# EAGLE design ProtoPowerSupply (EAGLE 7.6.0)
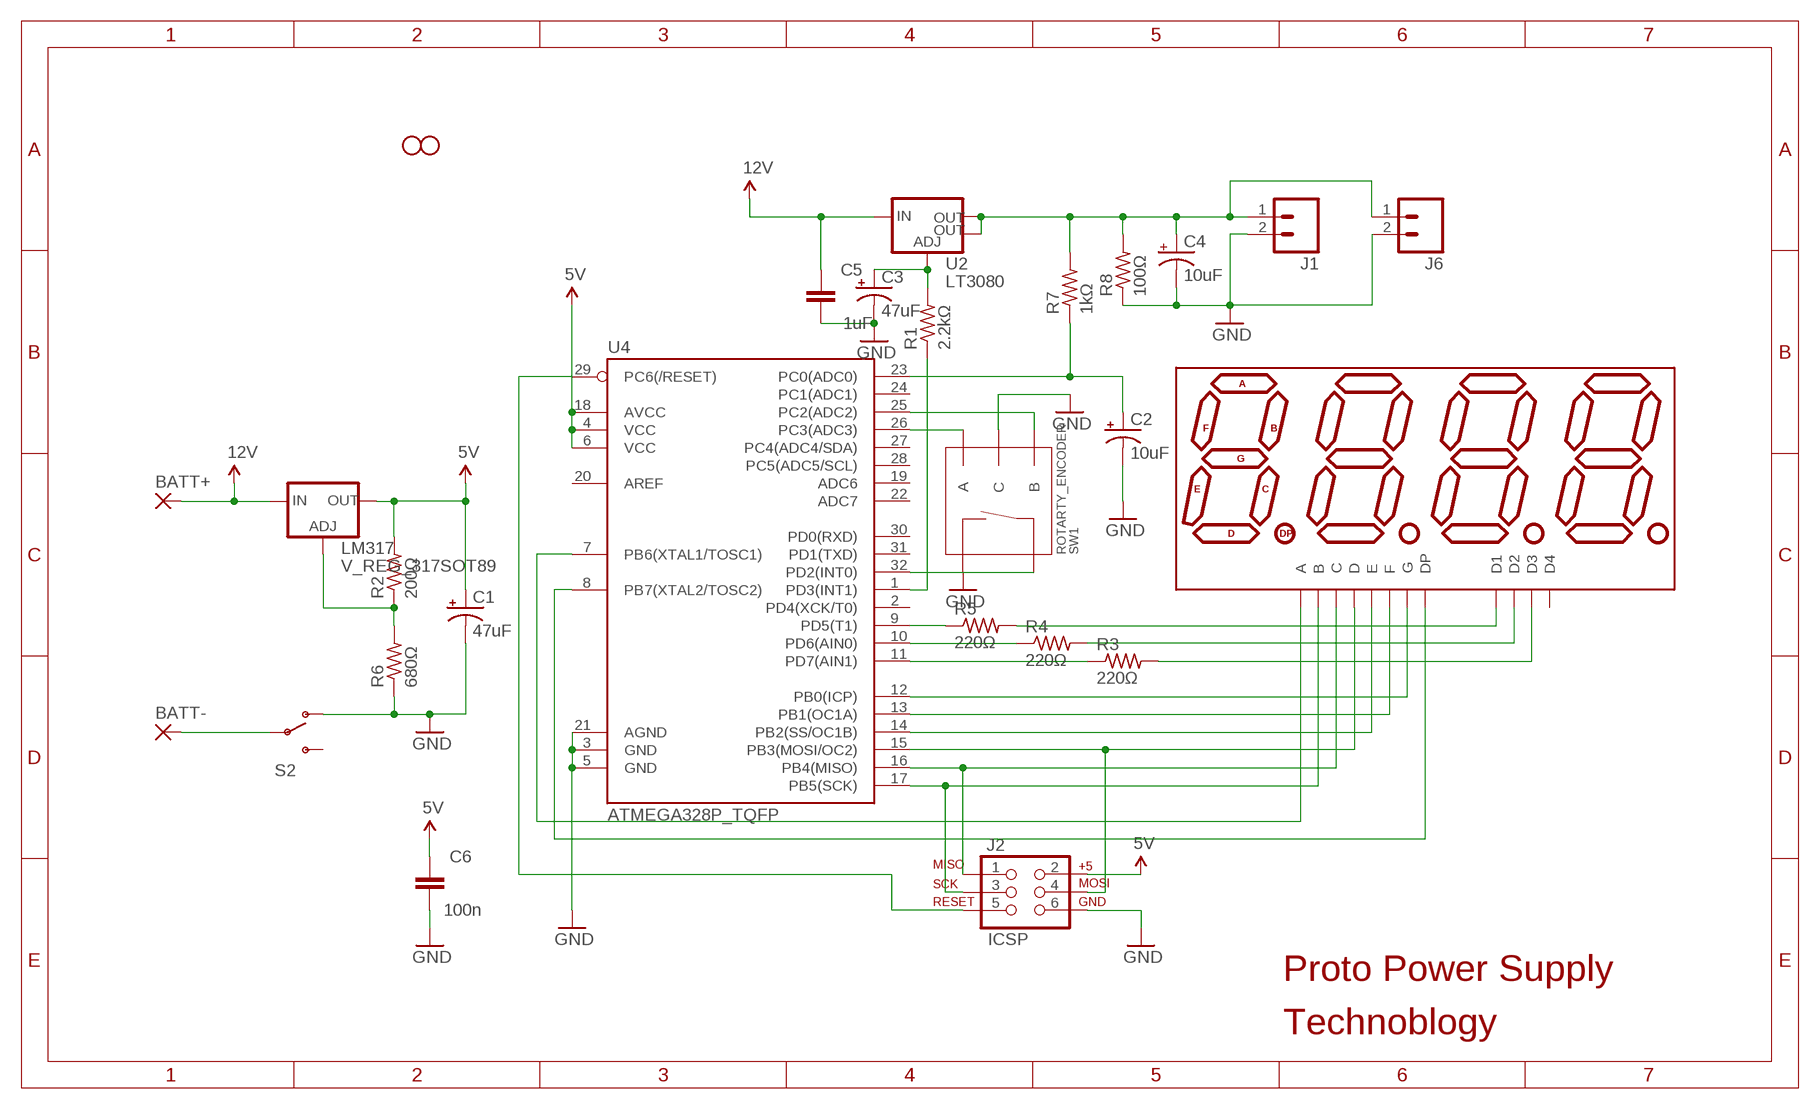
[diagram p0: schematic, sheet 1]

## Parts
BATT+  1,6/0,9  [1,6/0,9]
BATT-  1,6/0,9  [1,6/0,9]
C1  47uF  CAP_POLPTH2  [CPOL-RADIAL-10UF-25V]
C2  10uF  CAP_POLPTH2  [CPOL-RADIAL-10UF-25V]
C3  47uF  CAP_POLPTH2  [CPOL-RADIAL-10UF-25V]
C4  10uF  CAP_POLPTH2  [CPOL-RADIAL-10UF-25V]
C5  1uF  CAP0603-CAP  [0603-CAP]
C6  100n  CAP0603-CAP  [0603-CAP]
DISP1  KYX-2381  7-SEGMENT-4DIGIT-COUNTER-KYX-2381  [KYX-2381]
J1  M021X02_NO_SILK  [1X02_NO_SILK]
J2  ICSP  AVR_SPI_PRG_6PTH  [2X3]
J6  M021X02_NO_SILK  [1X02_NO_SILK]
JP4  STAND-OFF  [STAND-OFF]
JP5  STAND-OFF  [STAND-OFF]
LM317  V_REG_317SOT89  [SOT89]
R1  2.2kΩ  R-US_R0805  [R0805]
R2  200Ω  R-US_R0805  [R0805]
R3  220Ω  R-US_R0805  [R0805]
R4  220Ω  R-US_R0805  [R0805]
R5  220Ω  R-US_R0805  [R0805]
R6  680Ω  R-US_R0805  [R0805]
R7  1kΩ  R-US_R0805  [R0805]
R8  100Ω  R-US_R0805  [R0805]
S2  SWITCH-SPDTPTH  [SWITCH-SPDT]
SW1  ROTARTY_ENCODER  [ROTARY_ENC_PLAIN]
U2  LT3080  V_REG_LM1117SOT223  [SOT223]
U4  ATMEGA328P_TQFP  [TQFP32-08]

## Nets
5V: C1.1(+) C6.1 J2.2 LM317.2(OUT) R2.2 U4.4(VCC) U4.6(VCC) U4.18(AVCC)
12V: BATT+.1(P) C5.1 LM317.3(IN) U2.3(IN)
GND: C1.2(-) C2.2(-) C3.2(-) C4.2(-) C5.2 C6.2 J1.2 J2.6 J6.2 R6.1 R8.1 S2.1(O) SW1.C SW1.SW- U4.3(GND) U4.5(GND) U4.21(AGND)
N$2: DISP1.5(G) U4.12(PB0(ICP))
N$4: C2.1(+) R7.1 U4.23(PC0(ADC0))
N$5: C3.1(+) R1.2 U2.1(ADJ)
N$6: BATT-.1(P) S2.2(P)
N$7: DISP1.10(F) U4.13(PB1(OC1A))
N$8: DISP1.1(E) U4.14(PB2(SS/OC1B))
N$9: DISP1.2(D) J2.4 U4.15(PB3(MOSI/OC2))
N$10: DISP1.4(C) J2.1 U4.16(PB4(MISO))
N$11: DISP1.7(B) J2.3 U4.17(PB5(SCK))
N$12: DISP1.11(A) U4.7(PB6(XTAL1/TOSC1))
N$13: DISP1.12(D1) R5.2
N$14: DISP1.3(DP) U4.8(PB7(XTAL2/TOSC2))
N$15: DISP1.9(D2) R4.2
N$16: DISP1.8(D3) R3.2
N$17: R5.1 U4.9(PD5(T1))
N$18: R4.1 U4.10(PD6(AIN0))
N$19: R3.1 U4.11(PD7(AIN1))
N$20: SW1.B U4.25(PC2(ADC2))
N$21: SW1.SW+ U4.32(PD2(INT0))
N$27: SW1.A U4.26(PC3(ADC3))
N$29: J2.5 U4.29(PC6(/RESET))
N$30: R1.1 U4.1(PD3(INT1))
N$31: C4.1(+) J1.1 J6.1 R7.2 R8.2 U2.2(OUT) U2.4(OUT)
N$34: LM317.1(ADJ) R2.1 R6.2
Unconnected: DISP1.6(D4) S2.3(S) U4.2(PD4(XCK/T0)) U4.19(ADC6) U4.20(AREF) U4.22(ADC7) U4.24(PC1(ADC1)) U4.27(PC4(ADC4/SDA)) U4.28(PC5(ADC5/SCL)) U4.30(PD0(RXD)) U4.31(PD1(TXD))

## Notes on the sheet
- Proto Power Supply
- Technoblogy

## Library data of the parts
BATT+ BATT- = wirepad:1,6/0,9: THROUGH-HOLE PAD
C1-C4 = SparkFun-Capacitors:CAP_POL: Capacitor Polarized These are standard SMD and PTH capacitors. Normally 10uF, 47uF, and 100uF in electrolytic and tantalum varieties. Always verify the external diameter of the through hole cap, it varies with capacity, voltage, and manufacturer. The EIA devices should be standard.
C5 C6 = SparkFun-Capacitors:CAP: Capacitor Standard 0603 ceramic capacitor, and 0.1" leaded capacitor.
DISP1 = djd-displays:7-SEGMENT-4DIGIT-COUNTER
J1 J6 = SparkFun-Connectors:M02: Standard 2-pin 0.1" header. Use with - straight break away headers ( PRT-00116) - right angle break away headers (PRT-00553) - swiss pins (PRT-00743) - machine pins (PRT-00117) - female headers (PRT-00115) Molex polarized connector foot print use with: PRT-08233 with associated crimp pins and housings. 2.54_SCREWTERM for use with PRT-10571. 3.5mm Screw Terminal footprints for PRT-08084 5mm Screw Terminal footprints for use with PRT-08432
J2 = SparkFun:AVR_SPI_PRG_6: AVR ISP 6 Pin This is the reduced ISP connector for AVR programming. Common on Arduino. This footprint will take up less PCB space and can be used with a 10-pin to 6-pin adapter such as SKU: BOB-08508
JP4 JP5 = SparkFun:STAND-OFF: Stand Off This is the mechanical footprint for a #4 phillips button head screw. Use the keepout ring to avoid running the screw head into surrounding components. SKU : PRT-00447
LM317 = technoblogy:V_REG_317: Voltage Regulator Standard LM317 adjustable voltage regulator. AOI (Adjust Output Input). Google 'LM317 Calculator' for easy to use app to get the two resistor values needed. 240/720 for 5V output. 240/390 for 3.3V output. Spark Fun Electronics SKU : COM-00527
R1-R8 = adafruit:R-US_: RESISTOR, American symbol
S2 = SparkFun-Electromechanical:SWITCH-SPDT: SPDT Switch Simple slide switch, Spark Fun Electronics SKU : COM-00102 DPDT SMT slide switch, AYZ0202, SWCH-08179; PROD_ID: SWCH-08261
SW1 = SparkFun-Electromechanical:ROTARTY_ENCODER: Simple no LED rotary encoder Example: COM-09117
U2 = SparkFun-PowerIC:V_REG_LM1117: Voltage Regulator LM1117 Standard adjustable voltage regulator but in SMD form. Spark Fun Electronics SKU : COM-00595; PROD_ID: VREG-08170
U4 = SparkFun-DigitalIC:ATMEGA328P_TQFP; PROD_ID: IC-09069

## Board
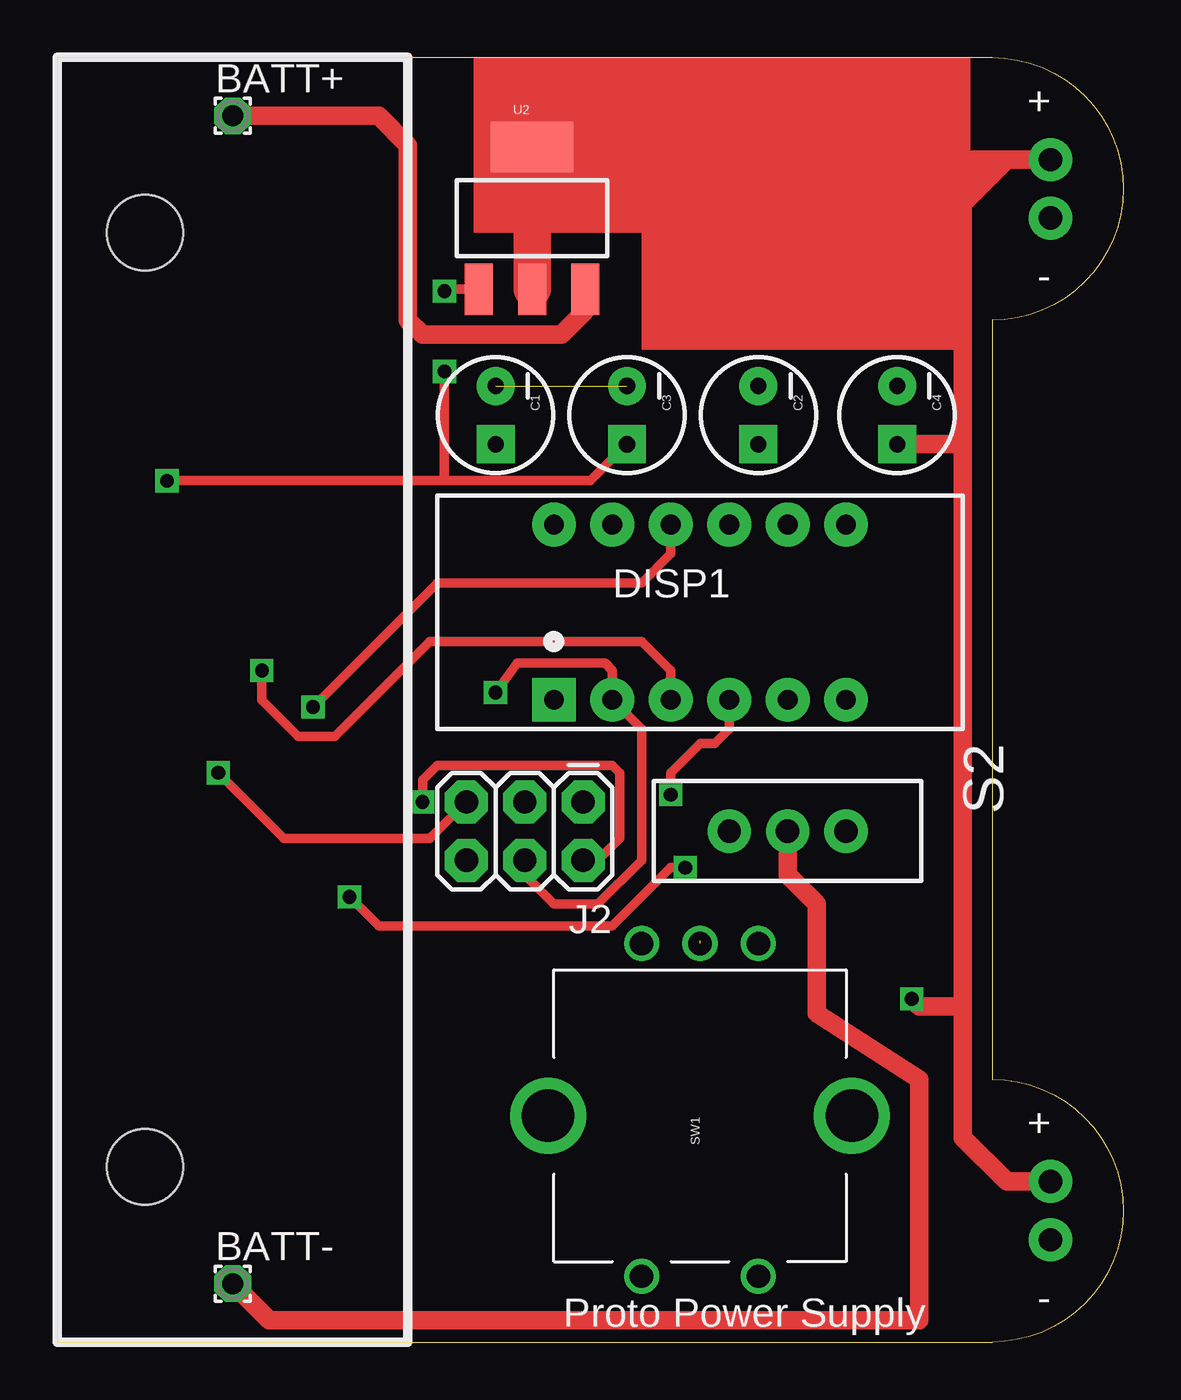
[diagram p1: board, top side]
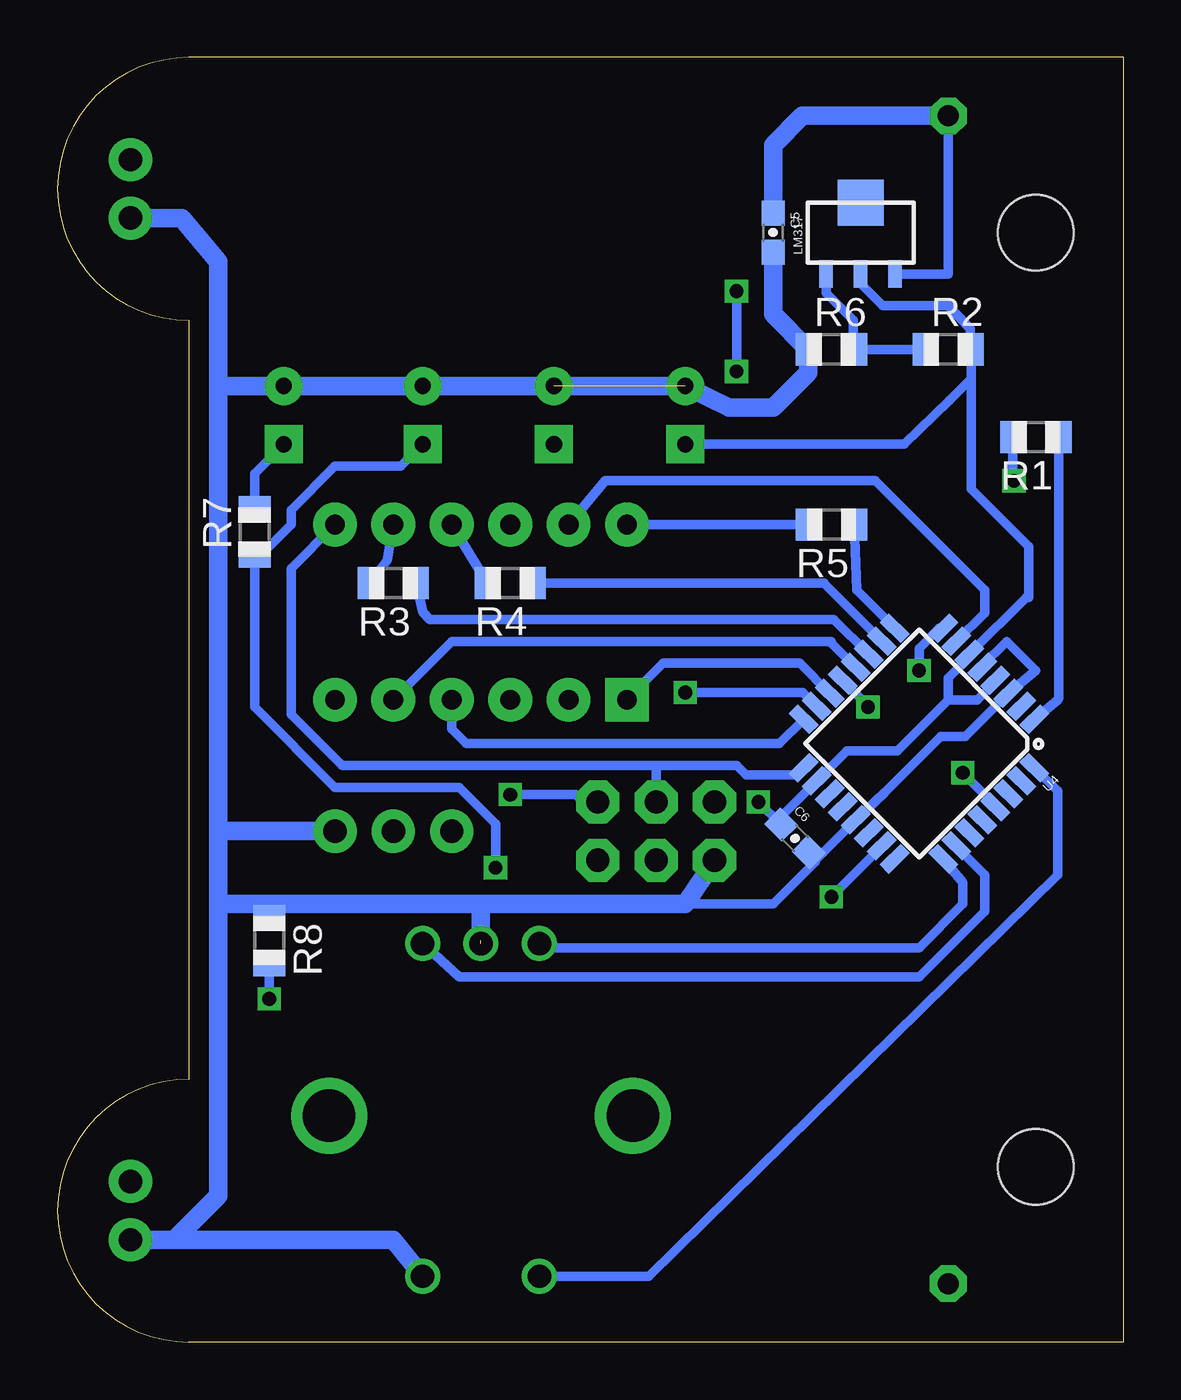
[diagram p2: board, bottom side, seen from below]

Size 46.36 x 55.88 mm. Coordinates in mm from the lower left corner, seen from the top.
Outline: 0,0 40.64,0 arc180 40.64,11.43 40.64,44.45 arc180 40.64,55.88 0,55.88 0,0
Copper layers (1*16): Top 0.035mm / dielectric 1.5mm / Bottom 0.035mm
Design rules "default": minimum track width 10mil, minimum drill 24mil, track to track 8mil, track to pad 8mil, pad to pad 8mil, via to via 8mil, smd to smd 8mil, copper to edge 40mil, drill to drill 8mil, minimum pad ring 10mil, minimum via ring 8mil, stop-mask expansion 4mil, vias tented up to drill 0mil, thermal gap 10mil

### Footprints (pad centres in the part's own frame; a part is rotated, then mirrored left to right if it is on the bottom)
1,6/0,9 = drill 0.914 pad 1.6 octagon: 1 0,0
CPOL-RADIAL-10UF-25V = drill 0.7 pad 1.651 square: 1 1.27,0 | drill 0.7 pad 1.651: 2 -1.27,0
0603-CAP = smd 1.1 x 1: 1 -0.85,0; 2 0.85,0
KYX-2381 = drill 0.864 pad 1.905 square: 1 -6.35,-3.81 | drill 0.864 pad 1.905: 2 -3.81,-3.81; 3 -1.27,-3.81; 4 1.27,-3.81; 5 3.81,-3.81; 6 6.35,-3.81; 7 6.35,3.81; 8 3.81,3.81; 9 1.27,3.81; 10 -1.27,3.81; 11 -3.81,3.81; 12 -6.35,3.81
1X02_NO_SILK = drill 1.016 pad 1.88: 1 0,0; 2 2.54,0
2X3 = drill 1.016 pad 1.88 octagon: 1 0,0; 2 0,2.54; 3 2.54,0; 4 2.54,2.54; 5 5.08,0; 6 5.08,2.54
STAND-OFF = hole 3.302: 0,0
SOT89 = smd 0.58 x 1.2: 1 -1.5,-1.8; 2 0,-1.8; 3 1.5,-1.8 | smd 2 x 2: 4 0,1.3
R0805 = smd 1.1 x 1.4: 1 -1,0; 2 1,0
SWITCH-SPDT = drill 1.016 pad 1.88: 1 0,2.54; 2 0,0; 3 0,-2.54
ROTARY_ENC_PLAIN = drill 1.016: A 7.493,-2.54; B 7.493,2.54; C 7.493,0; SW+ -6.985,2.54; SW- -6.985,-2.54 | drill 2.286: P$3 0,6.604; P$4 0,-6.604
SOT223 = smd 1.219 x 2.235: 1 -2.311,-3.099; 2 0,-3.099; 3 2.311,-3.099 | smd 3.6 x 2.2: 4 0,3.099
TQFP32-08 = smd 1.27 x 0.559: 1 -4.293,2.8; 2 -4.293,2; 3 -4.293,1.2; 4 -4.293,0.4; 5 -4.293,-0.4; 6 -4.293,-1.2; 7 -4.293,-2; 8 -4.293,-2.8; 17 4.293,-2.8; 18 4.293,-2; 19 4.293,-1.2; 20 4.293,-0.4; 21 4.293,0.4; 22 4.293,1.2; 23 4.293,2; 24 4.293,2.8 | smd 0.559 x 1.27: 9 -2.8,-4.293; 10 -2,-4.293; 11 -1.2,-4.293; 12 -0.4,-4.293; 13 0.4,-4.293; 14 1.2,-4.293; 15 2,-4.293; 16 2.8,-4.293; 25 2.8,4.293; 26 2,4.293; 27 1.2,4.293; 28 0.4,4.293; 29 -0.4,4.293; 30 -1.2,4.293; 31 -2,4.293; 32 -2.8,4.293

### Placement (x,y rotation side)
BATT+  7.62,53.34 0 top
BATT-  7.62,2.54 0 top
C1  19.05,40.32 270 top
C2  30.48,40.32 270 top
C3  24.77,40.32 270 top
C4  36.51,40.32 270 top
C5  15.24,48.26 270 bottom
C6  14.29,21.91 315 bottom
DISP1  27.94,31.75 0 top
J1  43.18,6.99 270 top
J2  22.86,23.5 180 top
J6  43.18,51.44 270 top
JP4  3.81,48.26 0 top
JP5  3.81,7.62 0 top
LM317  11.43,48.26 0 bottom
R1  3.81,39.37 180 bottom
R2  7.62,43.18 0 bottom
R3  31.75,33.02 180 bottom
R4  26.67,33.02 180 bottom
R5  12.7,35.56 180 bottom
R6  12.7,43.18 0 bottom
R7  37.78,35.24 90 bottom
R8  37.15,17.46 270 bottom
S2  31.75,22.23 270 top
SW1  27.94,9.84 90 top
U2  20.64,48.9 0 top
U4  8.89,26.04 225 bottom

### Tracks (layer width: path | path; a pad name or v marks a point on that pad's centre or on a via)
5V  (via drill 0.6)
  Top 0.406: J2.2 23.5,20.95 24.45,21.91 24.45,24.77 24.13,25.08 16.51,25.08 15.88,24.45 v15.88,23.5
  Bottom 0.406: 6.62,41.91 R2.2 6.67,44.09 7.62,45.09 10.48,45.09 11.43,46.04 LM317.2 | 6.62,41.91 6.62,37.1 4.13,34.61 4.13,32.38 4.24,32.38 U4.6 6.7,29.81 7.62,28.89 7.62,27.94 | 7.62,27.94 9.84,25.72 12.04,25.72 U4.18 14.89,22.86 C6.1 v15.88,23.5 | C1.1 9.53,39.05 7.57,40.96 6.62,41.91 | U4.4 5.57,28.72 6.35,27.94 7.62,27.94 | v15.88,23.5
12V
  Top 0.813: 8.89,53.34 BATT+.1 13.97,53.34 15.24,52.07 15.24,44.45 15.88,43.81 21.91,43.81 22.95,44.86 U2.3
  Bottom 0.406: BATT+.1 7.62,46.46 LM317.3
  Bottom 0.813: C5.1 15.24,52.07 13.97,53.34 BATT+.1
GND  (2 unrouted)
  Bottom 0.406: U4.21 10.37,23.92 7.94,26.35 6.88,26.35 U4.3 3.81,29.21 5.08,30.48 6.14,29.42 U4.5 | U4.21 13.4,20.95 13.4,20.89 15.24,19.05 19.05,19.05 | 39.37,41.59 39.37,41.91 | 39.32,13.92 39.37,15.24 | C6.2 13.05,21.31 U4.21
  Bottom 0.813: J6.2 40.96,48.9 39.37,46.99 39.37,41.91 39.37,22.23 | 39.37,22.23 39.37,19.05 | 39.37,19.05 39.37,15.24 39.37,6.35 41.27,4.45 | 41.27,4.45 J1.2 | S2.1 39.37,22.23 | 41.27,4.45 31.75,4.45 SW1.SW- | 39.37,41.59 C4.2 C2.2 C1.2 17.14,40.64 15.24,40.64 13.7,42.18 R6.1 15.24,44.72 C5.2 | J2.6 19.05,19.05 27.94,19.05 | 27.94,19.05 36.83,19.05 | 36.83,19.05 39.37,19.05 | 27.94,17.46 27.94,19.05 | R8.1 36.83,18.78 36.83,19.05
N$2
  Bottom 0.406: DISP1.5 29.21,30.48 12.7,30.48 12.7,30.41 U4.12
N$4  (via drill 0.6)
  Top 0.406: v12.7,19.37 13.97,18.1 24.13,18.1 26.67,20.64 v27.3,20.64
  Bottom 0.406: C2.1 31.43,38.1 34.29,38.1 36.2,36.2 36.2,35.56 37.51,34.24 R7.1 37.78,27.62 34.29,24.13 28.89,24.13 27.3,22.54 v27.3,20.64 | U4.23 10.51,21.56 v12.7,19.37
N$5  (via drill 0.6)
  Top 0.406: v4.76,37.47 16.83,37.47 | 16.83,37.47 23.18,37.47 C3.1 | U2.1 16.51,45.8 v16.83,45.72 | v16.83,42.23 16.83,37.47
  Bottom 0.406: R1.2 4.81,37.51 v4.76,37.47 | v16.83,45.72 v16.83,42.23
N$6
  Top 0.813: BATT-.1 9.21,0.95 37.47,0.95 37.47,11.43 33.02,14.29 33.02,19.05 31.75,20.32 S2.2
N$7  (via drill 0.6)
  Top 0.406: v11.11,27.62 16.51,33.02 25.4,33.02 26.67,34.29 DISP1.10
  Bottom 0.406: U4.13 11.11,27.69 v11.11,27.62
N$8
  Bottom 0.406: DISP1.1 20,29.53 14.08,29.53 U4.14
N$9  (via drill 0.6)
  Top 0.406: J2.4 20.32,20.32 21.59,19.05 23.5,19.05 25.4,20.95 25.4,26.67 DISP1.2 24.13,29.21 23.81,29.53 20,29.53 v19.05,28.26
  Bottom 0.406: U4.15 13.94,28.26 v19.05,28.26
N$10  (via drill 0.6)
  Top 0.406: v26.67,23.81 26.67,24.77 27.94,26.04 28.57,26.04 29.21,26.67 DISP1.4
  Bottom 0.406: U4.16 14.96,26.04 28.57,26.04 29.21,26.67 DISP1.4 | J2.1 23.5,23.5 23.81,23.81 v26.67,23.81
N$11
  Bottom 0.406: DISP1.7 36.2,33.66 36.2,27.3 33.97,25.08 20.32,25.08 | 20.32,25.08 16.83,25.08 16.41,24.66 14.22,24.66 U4.17 | J2.3 20.32,25.08
N$12
  Bottom 0.406: DISP1.11 22.54,37.47 10.79,37.47 6.03,32.7 6.03,31.72 U4.7
N$13
  Bottom 0.406: R5.2 DISP1.12
N$14  (via drill 0.6)
  Top 0.406: v8.89,29.21 8.89,27.94 10.48,26.35 12.06,26.35 16.19,30.48 25.4,30.48 26.67,29.21 DISP1.3
  Bottom 0.406: U4.8 8,31.05 8.89,30.16 v8.89,29.21
N$15
  Bottom 0.406: R4.2 DISP1.9
N$16
  Bottom 0.406: R3.2 32.02,34.02 DISP1.8
N$17
  Bottom 0.406: R5.1 11.6,32.7 U4.9
N$18
  Bottom 0.406: R4.1 13.02,33.02 13.02,32.99 U4.10
N$19
  Bottom 0.406: R3.1 30.48,31.75 30.16,31.43 12.59,31.43 U4.11
N$20
  Bottom 0.406: U4.25 6.99,20 6.99,19.05 8.89,17.14 25.21,17.14 SW1.B
N$21
  Bottom 0.406: SW1.SW+ 20.64,2.86 2.86,20.32 2.86,23.96 U4.32
N$27
  Bottom 0.406: SW1.A 28.89,15.88 8.89,15.88 6.03,18.73 6.03,20.32 7.27,21.56 U4.26
N$29  (via drill 0.6)
  Top 0.406: J2.5 16.19,21.91 9.84,21.91 v6.99,24.77
  Bottom 0.406: U4.29 5.57,23.35 v6.99,24.77
N$30
  Bottom 0.406: U4.1 2.86,27.94 2.81,27.99 R1.1
N$31  (via drill 0.6)
  Top 0.406: 39.37,39.05 39.37,39.37 | 21.83,52.07 U2.4
  Top 0.813: J6.1 41.27,51.44 | 41.27,51.44 39.37,49.53 39.37,39.37 39.37,14.61 | 39.37,14.61 39.37,8.89 41.27,6.99 J1.1 | C4.1 39.37,39.05 | 41.27,51.44 20.64,51.44 | v37.15,14.92 37.47,14.61 39.37,14.61
  Top 1.626: U2.2 20.64,51.44 U2.4
  Bottom 0.406: R7.2 37.78,37.78 C4.1 | R8.2 v37.15,14.92
N$34
  Bottom 0.406: R6.2 11.7,43.45 | R2.1 R6.2 | R6.2 11.75,43.23 11.75,44.45 12.93,45.63 LM317.1
(copper drawn outside any net)
  shapes: Top area x4

### Text on the board
tPlace: + | - | + | - | Proto Power Supply